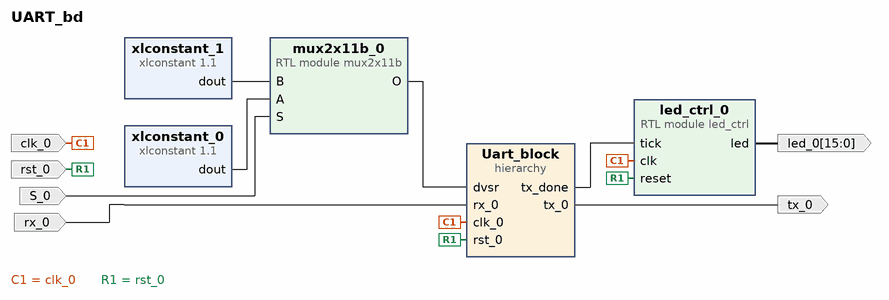
[diagram p0: block diagram of the top level]
# Vivado block design UART_bd, xc7a100tcsg324-1, Vivado 2018.2.1
create_bd_design UART_bd

create_bd_port -dir I S_0
create_bd_port -dir I -type clk clk_0
create_bd_port -dir I -type rst rst_0
create_bd_port -dir I rx_0
create_bd_port -dir O tx_0
create_bd_port -dir O -from 15 -to 0 led_0

create_bd_cell -type module -reference mux2x11b mux2x11b_0
create_bd_cell -type module -reference led_ctrl led_ctrl_0
create_bd_cell -type ip -vlnv xilinx.com:ip:xlconstant:1.1 xlconstant_0
set_property -dict {CONFIG.CONST_WIDTH 11 CONFIG.CONST_VAL 650} [get_bd_cells xlconstant_0]
create_bd_cell -type ip -vlnv xilinx.com:ip:xlconstant:1.1 xlconstant_1
set_property -dict {CONFIG.CONST_WIDTH 11 CONFIG.CONST_VAL 54} [get_bd_cells xlconstant_1]
create_bd_cell -type hier Uart_block

# ---- hierarchy /Uart_block ----
current_bd_instance /Uart_block
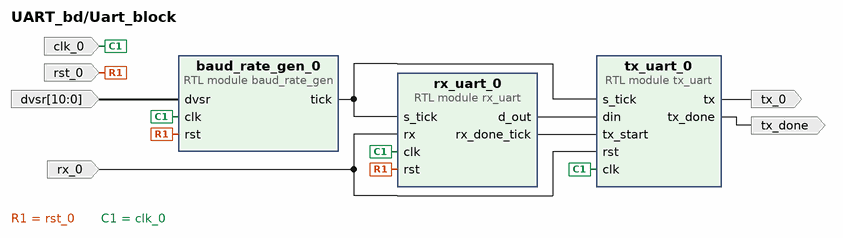
[diagram p1: block diagram inside /Uart_block]
create_bd_pin -dir I -type rst rst_0
create_bd_pin -dir I -type clk clk_0
create_bd_pin -dir I -from 10 -to 0 dvsr
create_bd_pin -dir I -type rst rx_0
create_bd_pin -dir O tx_0
create_bd_pin -dir O tx_done

create_bd_cell -type module -reference baud_rate_gen baud_rate_gen_0
create_bd_cell -type module -reference rx_uart rx_uart_0
create_bd_cell -type module -reference tx_uart tx_uart_0

# ---- connections ----

current_bd_instance /Uart_block
connect_bd_net [get_bd_pins baud_rate_gen_0/tick] [get_bd_pins rx_uart_0/s_tick] [get_bd_pins tx_uart_0/s_tick]
connect_bd_net [get_bd_pins rx_uart_0/d_out] [get_bd_pins tx_uart_0/din]
connect_bd_net [get_bd_pins rx_uart_0/rx_done_tick] [get_bd_pins tx_uart_0/tx_start]
connect_bd_net -net rst_0_1 [get_bd_pins rst_0] [get_bd_pins rx_uart_0/rst] [get_bd_pins baud_rate_gen_0/rst]
connect_bd_net -net clk_0_1 [get_bd_pins clk_0] [get_bd_pins rx_uart_0/clk] [get_bd_pins tx_uart_0/clk] [get_bd_pins baud_rate_gen_0/clk]
connect_bd_net -net mux2x11b_0_O [get_bd_pins dvsr] [get_bd_pins baud_rate_gen_0/dvsr]
connect_bd_net -net rx_0_1 [get_bd_pins rx_0] [get_bd_pins tx_uart_0/rst] [get_bd_pins rx_uart_0/rx]
connect_bd_net [get_bd_pins tx_uart_0/tx] [get_bd_pins tx_0]
connect_bd_net [get_bd_pins tx_uart_0/tx_done] [get_bd_pins tx_done]

current_bd_instance /
connect_bd_net [get_bd_pins xlconstant_1/dout] [get_bd_pins mux2x11b_0/B]
connect_bd_net [get_bd_pins xlconstant_0/dout] [get_bd_pins mux2x11b_0/A]
connect_bd_net -net S_0_1 [get_bd_ports S_0] [get_bd_pins mux2x11b_0/S]
connect_bd_net [get_bd_pins mux2x11b_0/O] [get_bd_pins Uart_block/dvsr]
connect_bd_net -net clk_0_1 [get_bd_ports clk_0] [get_bd_pins led_ctrl_0/clk] [get_bd_pins Uart_block/clk_0]
connect_bd_net -net rst_0_1 [get_bd_ports rst_0] [get_bd_pins led_ctrl_0/reset] [get_bd_pins Uart_block/rst_0]
connect_bd_net -net rx_0_1 [get_bd_ports rx_0] [get_bd_pins Uart_block/rx_0]
connect_bd_net -net tx_uart_0_tx_done [get_bd_pins Uart_block/tx_done] [get_bd_pins led_ctrl_0/tick]
connect_bd_net -net tx_uart_0_tx [get_bd_pins Uart_block/tx_0] [get_bd_ports tx_0]
connect_bd_net [get_bd_pins led_ctrl_0/led] [get_bd_ports led_0]

validate_bd_design
save_bd_design
